# EAGLE schematic IRRemoteModule (EAGLE 7.1.0)
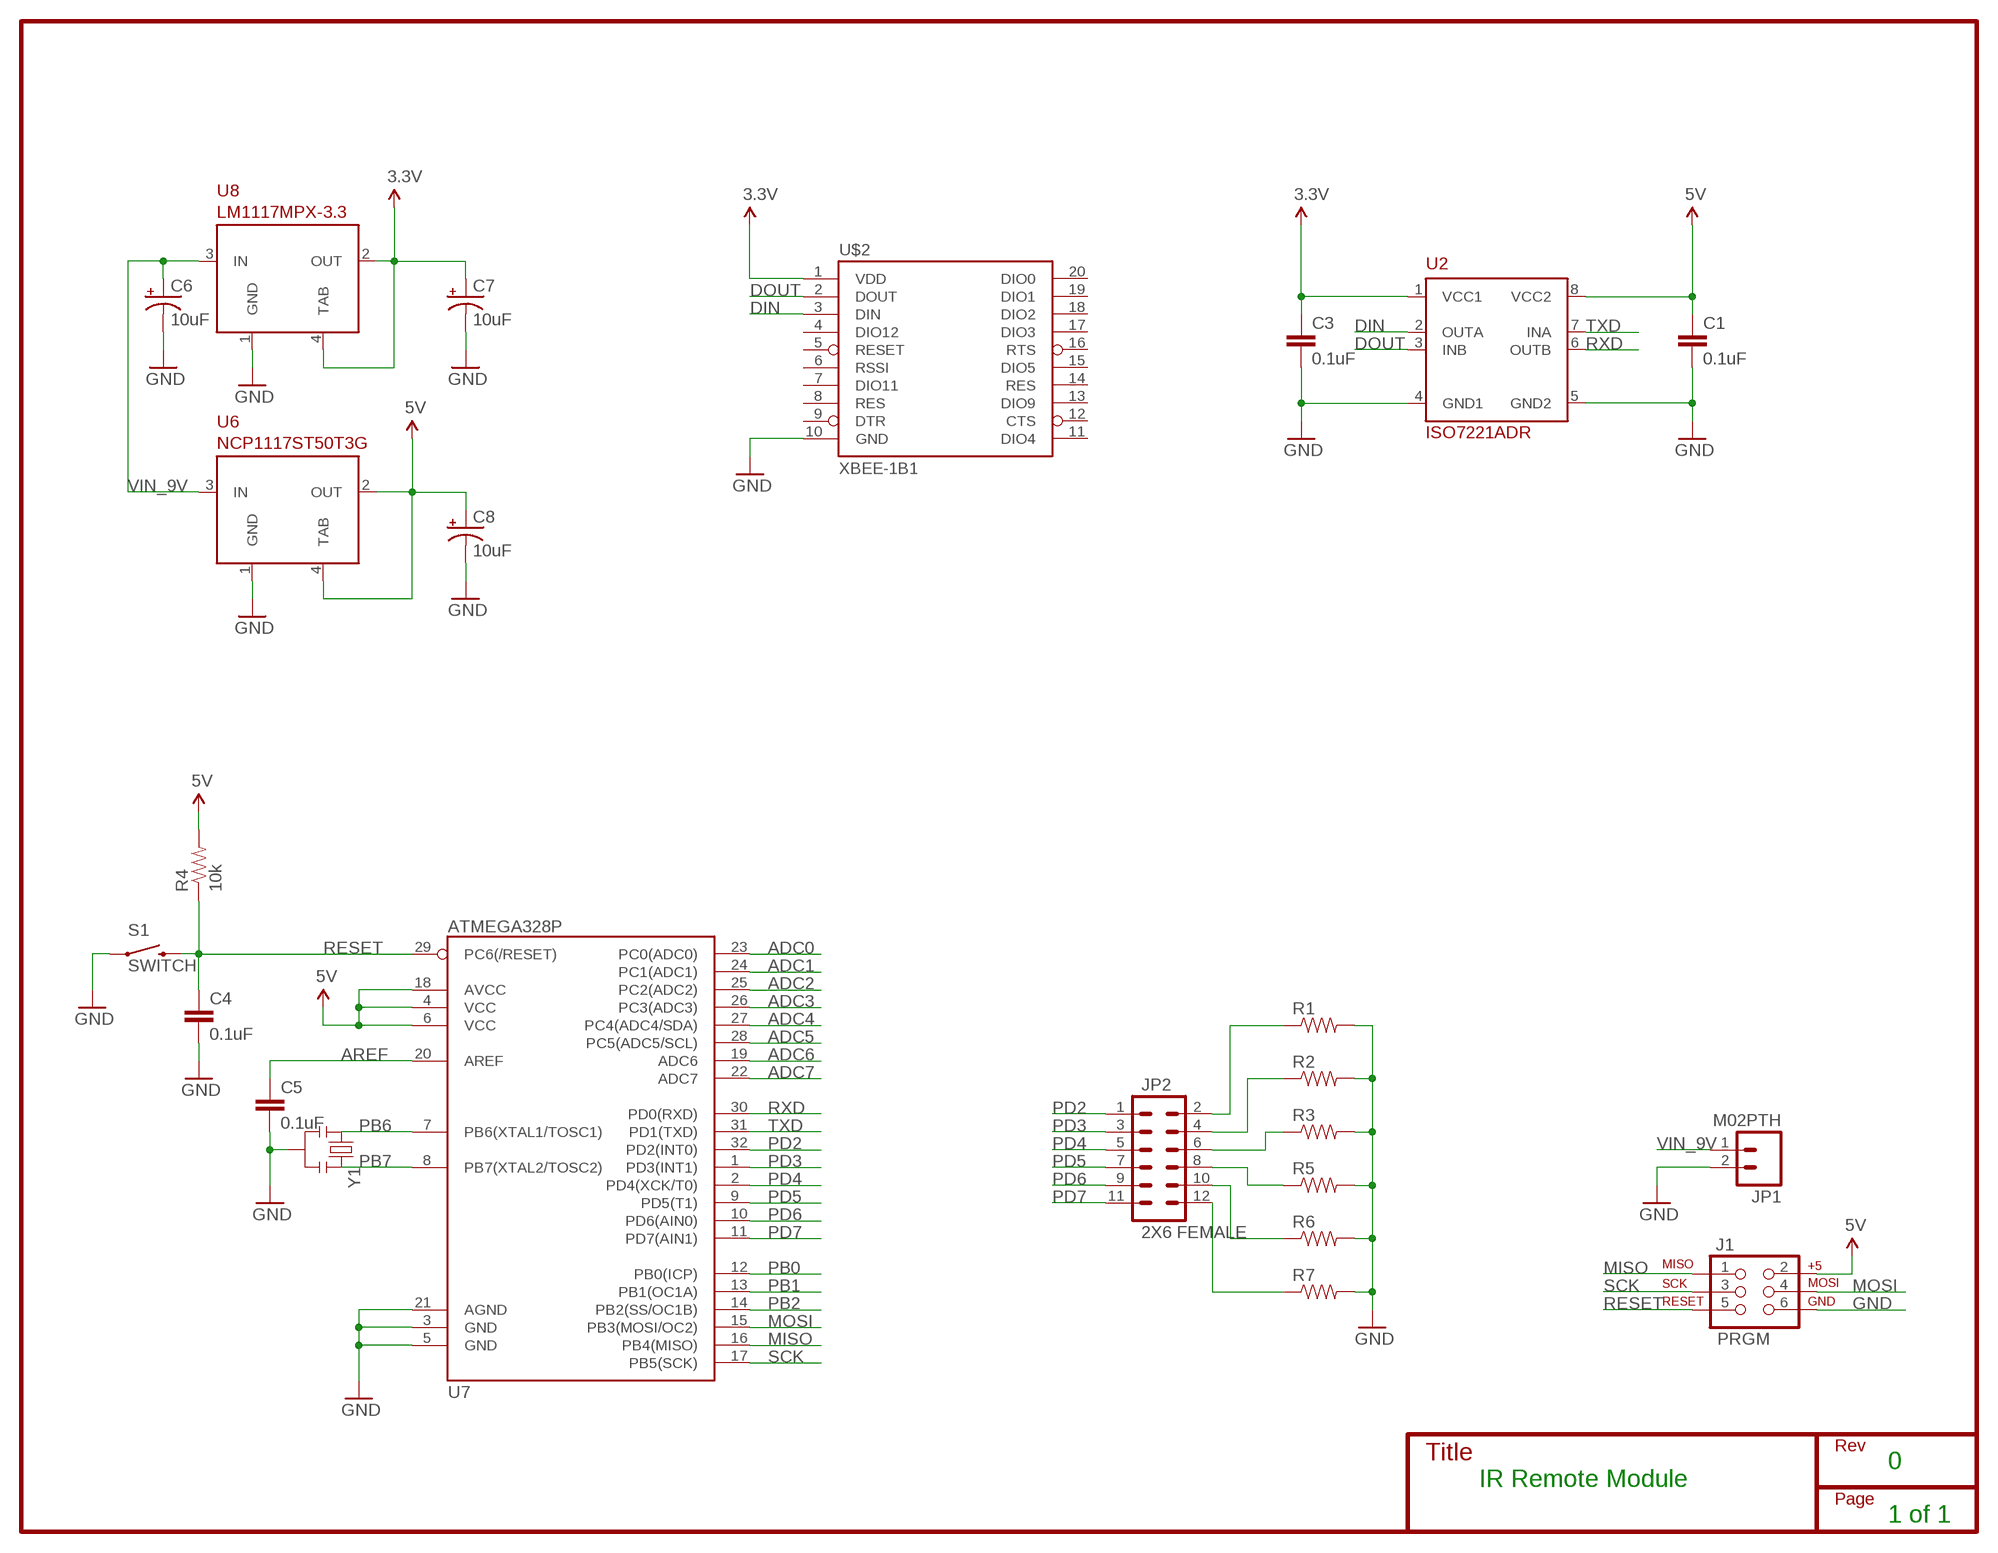
[diagram p0: schematic, sheet 1]

## Parts
C1  0.1uF  CAP0603-CAP  [0603-CAP]
C3  0.1uF  CAP0603-CAP  [0603-CAP]
C4  0.1uF  CAP0603-CAP  [0603-CAP]
C5  0.1uF  CAP0603-CAP  [0603-CAP]
C6  10uF  CAP_POL6032  [EIA6032]
C7  10uF  CAP_POL6032  [EIA6032]
C8  10uF  CAP_POL6032  [EIA6032]
J1  PRGM  AVR_SPI_PRG_6PTH  [2X3]
JP1  M02PTH  [1X02]
JP2  2X6 FEMALE  M06X2PTH_FEMALE  [2X6]
R1  RESISTOR0603  [0603-RES]
R2  RESISTOR0603  [0603-RES]
R3  RESISTOR0603  [0603-RES]
R4  10k  RESISTOR0603-RES  [0603-RES]
R5  RESISTOR0603  [0603-RES]
R6  RESISTOR0603  [0603-RES]
R7  RESISTOR0603  [0603-RES]
S1  SWITCH  SWITCH-MOMENTARY-2SMD  [TACTILE_SWITCH_SMD]
U2  ISO7221ADR  [SO08]
U6  NCP1117ST50T3G  [SOT223]
U7  ATMEGA328P  ATMEGA328_SMT  [TQFP32-08]
U8  LM1117MPX-3.3  [SOT223]
U$2  XBEE-1B1  [XBEE-1]
Y1  RESONATORPTH  [RESONATOR-PTH]

## Nets
3.3V: C3.1 C7.P$1(+) U2.1(VCC1) U8.2(OUT) U8.4(TAB) U$2.1(VDD)
5V: C1.1 C8.P$1(+) J1.2 R4.2 U2.8(VCC2) U6.2(OUT) U6.4(TAB) U7.4(VCC) U7.6(VCC) U7.18(AVCC)
ADC0: U7.23(PC0(ADC0))
ADC1: U7.24(PC1(ADC1))
ADC2: U7.25(PC2(ADC2))
ADC3: U7.26(PC3(ADC3))
ADC4: U7.27(PC4(ADC4/SDA))
ADC5: U7.28(PC5(ADC5/SCL))
ADC6: U7.19(ADC6)
ADC7: U7.22(ADC7)
AREF: C5.1 U7.20(AREF)
DIN: U2.2(OUTA) U$2.3(DIN)
DOUT: U2.3(INB) U$2.2(DOUT)
GND: C1.2 C3.2 C4.2 C5.2 C6.P$2(-) C7.P$2(-) C8.P$2(-) J1.6 JP1.2 R1.2 R2.2 R3.2 R5.2 R6.2 R7.2 S1.1 U2.4(GND1) U2.5(GND2) U6.1(GND) U7.3(GND) U7.5(GND) U7.21(AGND) U8.1(GND) U$2.10(GND) Y1.2
MISO: J1.1 U7.16(PB4(MISO))
MOSI: J1.4 U7.15(PB3(MOSI/OC2))
N$7: JP2.6 R3.1
N$8: JP2.4 R2.1
N$9: JP2.2 R1.1
N$10: JP2.8 R5.1
N$11: JP2.10 R6.1
N$12: JP2.12 R7.1
PB0: U7.12(PB0(ICP))
PB1: U7.13(PB1(OC1A))
PB2: U7.14(PB2(SS/OC1B))
PB6: U7.7(PB6(XTAL1/TOSC1)) Y1.1
PB7: U7.8(PB7(XTAL2/TOSC2)) Y1.3
PD2: JP2.1 U7.32(PD2(INT0))
PD3: JP2.3 U7.1(PD3(INT1))
PD4: JP2.5 U7.2(PD4(XCK/T0))
PD5: JP2.7 U7.9(PD5(T1))
PD6: JP2.9 U7.10(PD6(AIN0))
PD7: JP2.11 U7.11(PD7(AIN1))
RESET: C4.1 J1.5 R4.1 S1.3 U7.29(PC6(/RESET))
RXD: U2.6(OUTB) U7.30(PD0(RXD))
SCK: J1.3 U7.17(PB5(SCK))
TXD: U2.7(INA) U7.31(PD1(TXD))
VIN_9V: C6.P$1(+) JP1.1 U6.3(IN) U8.3(IN)
Unconnected: U$2.4(DIO12) U$2.5(RESET) U$2.6(RSSI) U$2.7(DIO11) U$2.8(RES) U$2.9(DTR) U$2.11(DIO4) U$2.12(CTS) U$2.13(DIO9) U$2.14(RES) U$2.15(DIO5) U$2.16(RTS) U$2.17(DIO3) U$2.18(DIO2) U$2.19(DIO1) U$2.20(DIO0)

## Notes on the sheet
- 0
- IR Remote Module
- 1 of 1

## Library data of the parts
C1 C3 C5 = SparkFun-Passives:CAP: Capacitor Standard 0603 ceramic capacitor, and 0.1" leaded capacitor.
C4 = SparkFun-Capacitors:CAP: Capacitor Standard 0603 ceramic capacitor, and 0.1" leaded capacitor.
C6-C8 = SparkFun-Capacitors:CAP_POL: Capacitor Polarized These are standard SMD and PTH capacitors. Normally 10uF, 47uF, and 100uF in electrolytic and tantalum varieties. Always verify the external diameter of the through hole cap, it varies with capacity, voltage, and manufacturer. The EIA devices should be standard.
J1 = SparkFun-Connectors:AVR_SPI_PRG_6: AVR ISP 6 Pin This is the reduced ISP connector for AVR programming. Common on Arduino. This footprint will take up less PCB space and can be used with a 10-pin to 6-pin adapter such as SKU: BOB-08508
JP1 = SparkFun-Connectors:M02: Standard 2-pin 0.1" header. Use with - straight break away headers ( PRT-00116) - right angle break away headers (PRT-00553) - swiss pins (PRT-00743) - machine pins (PRT-00117) - female headers (PRT-00115) Molex polarized connector foot print use with: PRT-08233 with associated crimp pins and housings. 2.54_SCREWTERM for use with PRT-10571. 3.5mm Screw Terminal footprints for PRT-08084 5mm Screw Terminal footprints for use with PRT-08432
JP2 = SparkFun-Connectors:M06X2; PROD_ID: CONN-12423
R1-R3 R5-R7 = SparkFun-Resistors:RESISTOR: Resistor Basic schematic elements and footprints for 0603, 1206, and PTH resistors.
R4 = SparkFun-Passives:RESISTOR: Resistor Basic schematic elements and footprints for 0603, 1206, and PTH resistors.
S1 = SparkFun-Electromechanical:SWITCH-MOMENTARY-2: Various NO switches- pushbuttons, reed, etc; PROD_ID: SWCH-08247
U2 = DigitalICs:ISO7221ADR: ISO7221 Dual Channel Digital Isolator from Texas Instruments. See Datasheet for more info Datasheet <http://www.ti.com/lit/ds/symlink/iso7220a.pdf>; DIGIKEYPART#: 296-21955-1-ND
U6 = regulators:NCP1117ST50T3G: NCP1117 5V, 1.0 A Low-Dropout Positive Fixed and Adjustable Voltage Regulator Datasheet <http://www.onsemi.com/pub_link/Collateral/NCP1117-D.PDF>; DIGIKEYPART#: NCP1117ST50T3GOSCT-ND
U7 = SparkFun-DigitalIC:ATMEGA328_SMT: 32-Pin Atmega328 part Commonly used on Arduino compatible boards Available in QFP and QFN packages TQFP is IC-09069 QFN is non-stock; PROD_ID: IC-09069
U8 = regulators:LM1117MPX-3.3: 3.3V Low Dropout Regulator, 0.8A output. See datasheet for more info Datasheet <http://www.ti.com/lit/ds/symlink/lm1117-n.pdf>; DIGIKEYPART#: LM1117MPX-3.3/NOPBCT-ND
U$2 = SparkFun-RF:XBEE-1: Xbee module footprints SMT header is CONN-09042.
Y1 = SparkFun-FreqCtrl:RESONATOR: Resonator Small SMD resonator. Used, eg, on the Arduino Pro/ Pro Mini boards. 8MHz- XTAL-08895 16MHz- XTAL-08900